# Altium schematic sheet Filter Capacitors - I2C.SchDoc: I2C Filter Capacitors
size A4; DocumentNumber: 43; SheetNumber: 43; SheetTotal: 54
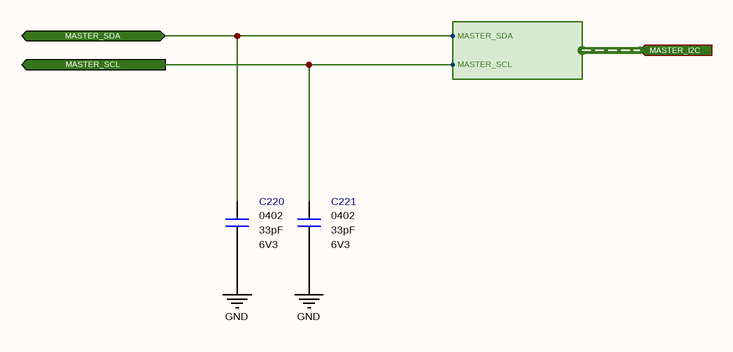
[diagram p0: Filter Capacitors - I2C.SchDoc]

## Parts
C220  value 33pF  Case: 0402  Voltage: 6V3  [CAPACITOR_0402]  (hidden comment: Multilayer Ceramic Capacitor)
C221  value 33pF  Case: 0402  Voltage: 6V3  [CAPACITOR_0402]  (hidden comment: Multilayer Ceramic Capacitor)

## Ports
MASTER_I2C (in, harness MASTER_I2C), MASTER_SCL (out), MASTER_SDA (bidir)

## Harnesses
MASTER_I2C: MASTER_SDA, MASTER_SCL

## Nets
GND: C220.1 C221.1
MASTER_SCL: C221.2 ; port MASTER_SCL, port MASTER_I2C.MASTER_SCL
MASTER_SDA: C220.2 ; port MASTER_SDA, port MASTER_I2C.MASTER_SDA

## Notes on the sheet
- Engineer
- All Rights are reserved to Customer and Engineer. [2021]
- Size:
- Date:
- A4
- Project :
- Time:
- Sheet
- of
- Customer
- Product ID
- Module ID
- Version
- File:
- Revision

## Library data of the parts
C220 C221 = Capacitor - 33pF [0402-6V3]: Capacitor - 33pF [0402] (Ceramic); Manufacturer Name: Kemet; Manufacturer Part Number: C0402C330J9RACAUTO; Dielectric: X7R; Tolerance: 10%; Height: 0.5mm; Maximum Operating Temperature: +125; Minimum Operating Temperature: -55; ROHS: Yes; ComponentLink1Description: DataSheet; ComponentLink1URL: https://api.kemet.com/component-edge/download/datasheet/C0402C330J9RACAUTO.pdf; ComponentLink2Description: Mouser; ComponentLink2URL: https://www.mouser.com/Search/Refine.aspx?Keyword=80-C0402C330J9RAUTO; Supplier 1: Mouser; Supplier Part Number 1: 80-C0402C330J9RAUTO; Mouser Part Number: 80-C0402C330J9RAUTO